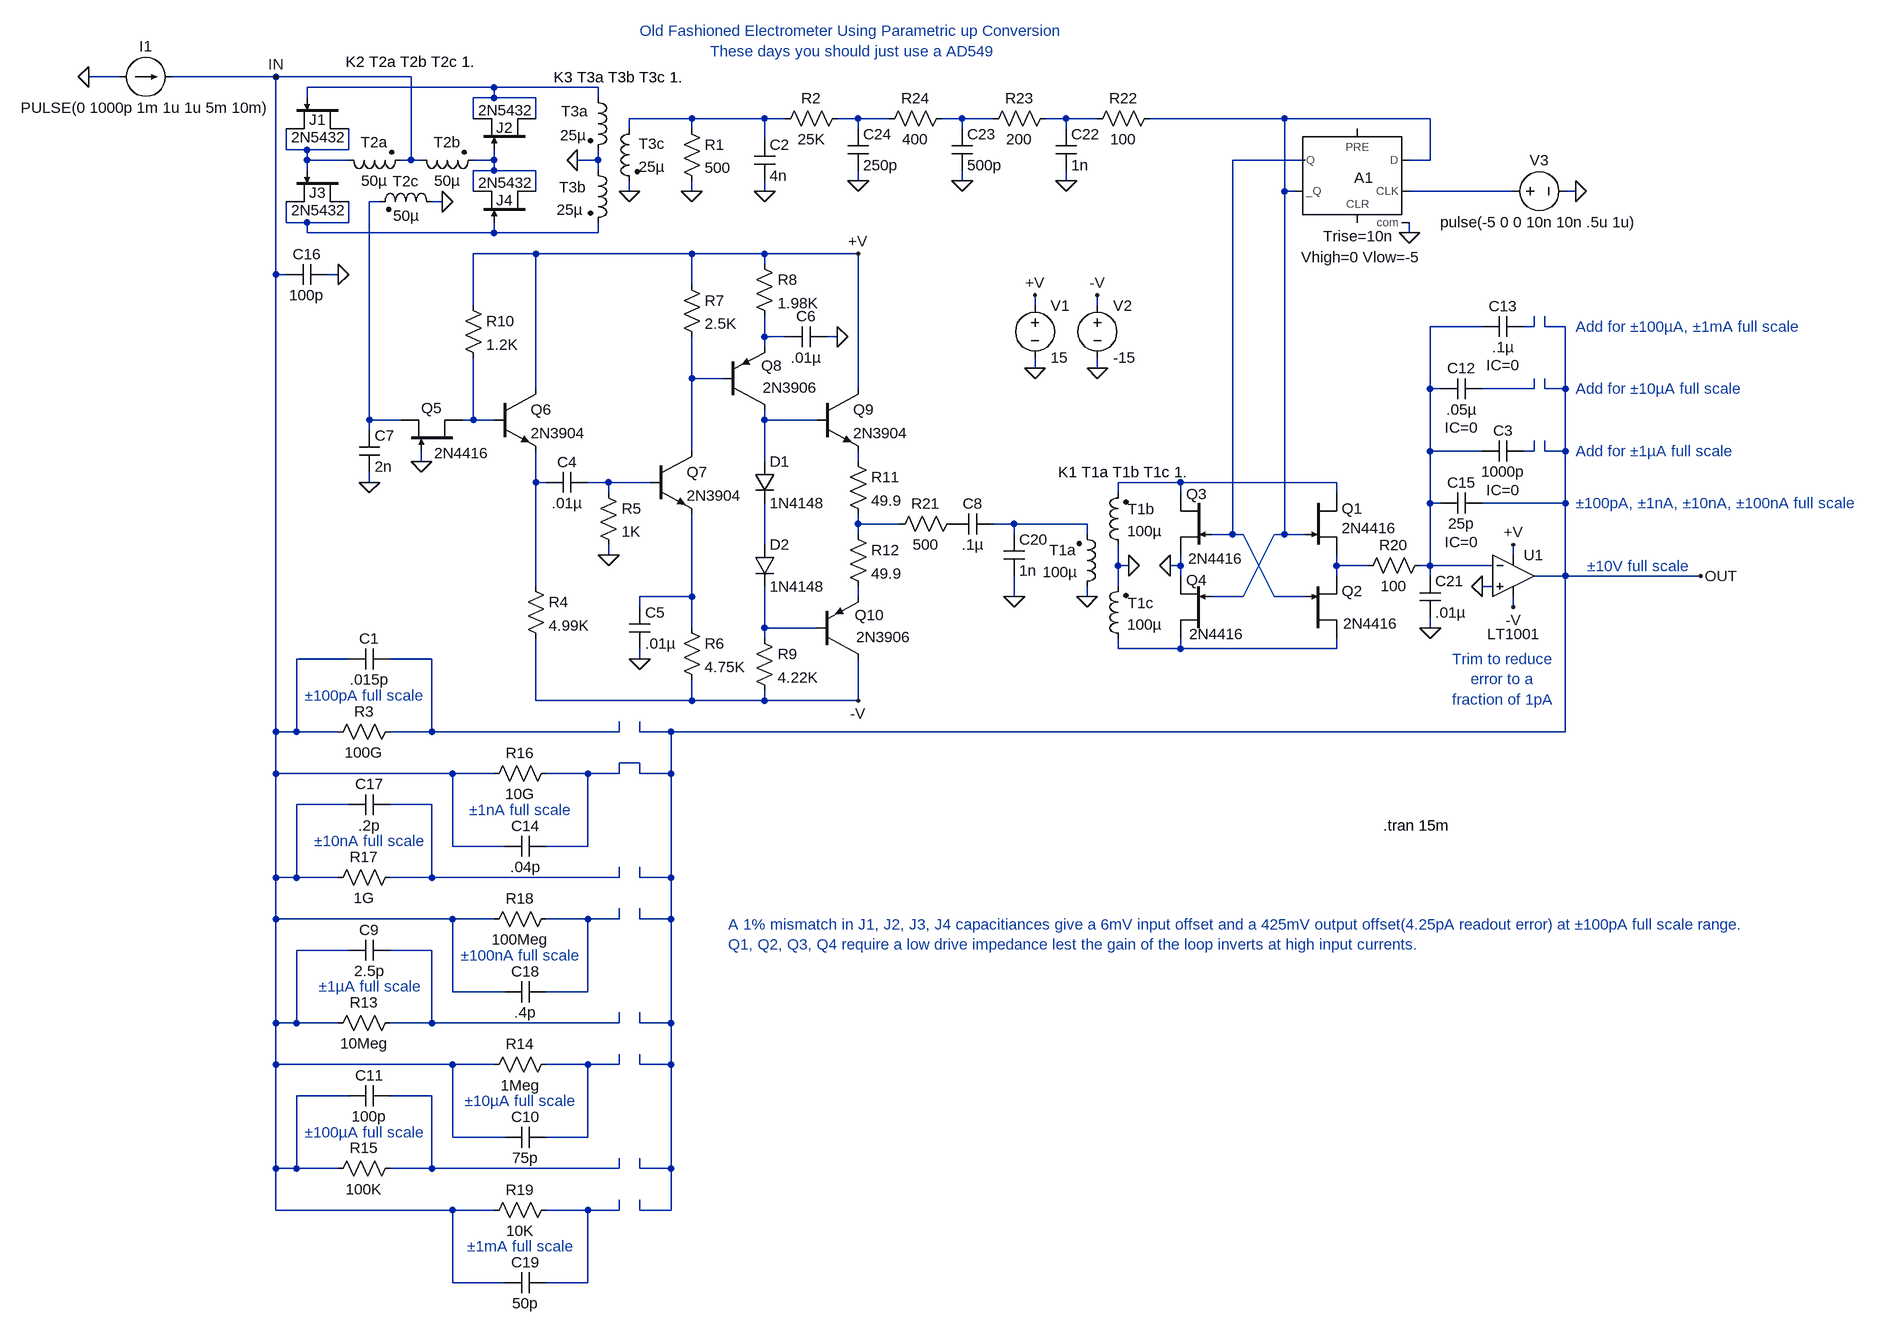
[diagram p0: schematic Electrometer.asc]
Electrometer.asc, the LTspice schematic file:
Version 4
SHEET 1 2884 3000
WIRE -1152 240 -1200 240
WIRE -912 240 -1072 240
WIRE -704 240 -912 240
WIRE -576 256 -864 256
WIRE -416 256 -576 256
WIRE -864 272 -864 256
WIRE -576 272 -576 256
WIRE -576 272 -608 272
WIRE -512 272 -576 272
WIRE -416 272 -416 256
WIRE -608 304 -608 272
WIRE -512 304 -512 272
WIRE -272 304 -368 304
WIRE -160 304 -272 304
WIRE -128 304 -160 304
WIRE -16 304 -48 304
WIRE 32 304 -16 304
WIRE 144 304 112 304
WIRE 192 304 144 304
WIRE 304 304 272 304
WIRE 352 304 304 304
WIRE 640 304 432 304
WIRE 864 304 640 304
WIRE -368 320 -368 304
WIRE -272 320 -272 304
WIRE -16 320 -16 304
WIRE 144 320 144 304
WIRE 304 320 304 304
WIRE -160 336 -160 304
WIRE -896 352 -896 320
WIRE -864 352 -896 352
WIRE -800 352 -800 320
WIRE -800 352 -864 352
WIRE -864 368 -864 352
WIRE -800 368 -864 368
WIRE -704 368 -704 240
WIRE -704 368 -720 368
WIRE -688 368 -704 368
WIRE -576 368 -576 352
WIRE -576 368 -608 368
WIRE -416 368 -416 352
WIRE -416 368 -448 368
WIRE 672 368 560 368
WIRE 864 368 864 304
WIRE 864 368 832 368
WIRE -864 384 -864 368
WIRE -576 384 -576 368
WIRE -576 384 -608 384
WIRE -512 384 -576 384
WIRE -416 384 -416 368
WIRE -16 400 -16 384
WIRE 144 400 144 384
WIRE 304 400 304 384
WIRE -608 416 -608 384
WIRE -512 416 -512 384
WIRE -368 416 -368 400
WIRE -272 416 -272 400
WIRE -160 416 -160 400
WIRE 640 416 640 304
WIRE 656 416 640 416
WIRE 992 416 832 416
WIRE 1088 416 1072 416
WIRE -752 432 -768 432
WIRE -656 432 -672 432
WIRE -896 464 -896 432
WIRE -864 464 -896 464
WIRE -800 464 -800 432
WIRE -800 464 -864 464
WIRE -864 480 -864 464
WIRE -576 480 -576 464
WIRE -576 480 -864 480
WIRE -416 480 -416 464
WIRE -416 480 -576 480
WIRE 832 480 832 464
WIRE -512 512 -608 512
WIRE -272 512 -512 512
WIRE -160 512 -272 512
WIRE -16 512 -160 512
WIRE -160 528 -160 512
WIRE -912 544 -912 240
WIRE -896 544 -912 544
WIRE -816 544 -832 544
WIRE -272 560 -272 512
WIRE -608 592 -608 512
WIRE 256 592 256 576
WIRE 352 592 352 576
WIRE 944 624 864 624
WIRE 1024 624 1024 608
WIRE 1024 624 1008 624
WIRE 1040 624 1040 608
WIRE 1072 624 1040 624
WIRE -160 640 -160 608
WIRE -128 640 -160 640
WIRE -48 640 -64 640
WIRE -160 656 -160 640
WIRE 256 688 256 672
WIRE 352 688 352 672
WIRE -272 704 -272 640
WIRE -224 704 -272 704
WIRE -512 720 -512 512
WIRE -16 720 -16 512
WIRE 864 720 864 624
WIRE 880 720 864 720
WIRE 1024 720 1024 704
WIRE 1024 720 944 720
WIRE 1040 720 1040 704
WIRE 1072 720 1072 624
WIRE 1072 720 1040 720
WIRE -768 768 -768 432
WIRE -720 768 -768 768
WIRE -608 768 -608 672
WIRE -608 768 -624 768
WIRE -576 768 -608 768
WIRE -160 768 -160 752
WIRE -80 768 -160 768
WIRE -768 784 -768 768
WIRE -272 816 -272 704
WIRE 864 816 864 720
WIRE 944 816 864 816
WIRE 1024 816 1024 800
WIRE 1024 816 1008 816
WIRE 1040 816 1040 800
WIRE 1072 816 1072 720
WIRE 1072 816 1040 816
WIRE -688 832 -688 816
WIRE -160 832 -160 768
WIRE -16 832 -16 816
WIRE -768 864 -768 848
WIRE -512 864 -512 816
WIRE -496 864 -512 864
WIRE -400 864 -432 864
WIRE -336 864 -400 864
WIRE 480 864 384 864
WIRE 720 864 480 864
WIRE -400 880 -400 864
WIRE 384 880 384 864
WIRE 480 880 480 864
WIRE 720 880 720 864
WIRE 864 896 864 816
WIRE 880 896 864 896
WIRE 1072 896 1072 816
WIRE 1072 896 944 896
WIRE -16 928 -16 912
WIRE 48 928 -16 928
WIRE 224 928 192 928
WIRE 336 928 224 928
WIRE -16 944 -16 928
WIRE 224 944 224 928
WIRE 336 944 336 928
WIRE 560 944 560 368
WIRE 560 944 528 944
WIRE 576 944 560 944
WIRE 640 944 640 416
WIRE 640 944 624 944
WIRE 672 944 640 944
WIRE -160 960 -160 896
WIRE -400 976 -400 960
WIRE 992 976 992 960
WIRE 384 992 384 960
WIRE 400 992 384 992
WIRE 480 992 480 976
WIRE 480 992 464 992
WIRE 720 992 720 976
WIRE 768 992 720 992
WIRE 864 992 864 896
WIRE 864 992 848 992
WIRE 960 992 864 992
WIRE 480 1008 480 992
WIRE 720 1008 720 992
WIRE 864 1008 864 992
WIRE 1072 1008 1072 896
WIRE 1072 1008 1024 1008
WIRE 1280 1008 1072 1008
WIRE -512 1024 -512 864
WIRE 384 1024 384 992
WIRE 960 1024 944 1024
WIRE -272 1040 -272 912
WIRE -272 1040 -352 1040
WIRE -16 1040 -16 1024
WIRE 224 1040 224 1008
WIRE 336 1040 336 1024
WIRE 576 1040 624 944
WIRE 576 1040 528 1040
WIRE 624 1040 576 944
WIRE 672 1040 624 1040
WIRE -352 1056 -352 1040
WIRE 992 1056 992 1040
WIRE -272 1088 -272 1040
WIRE -160 1088 -160 1024
WIRE -80 1088 -160 1088
WIRE 864 1088 864 1072
WIRE -160 1104 -160 1088
WIRE 384 1120 384 1104
WIRE 480 1120 480 1104
WIRE 480 1120 384 1120
WIRE 720 1120 720 1104
WIRE 720 1120 480 1120
WIRE -800 1136 -880 1136
WIRE -672 1136 -736 1136
WIRE -352 1136 -352 1120
WIRE -512 1200 -512 1104
WIRE -272 1200 -272 1168
WIRE -272 1200 -512 1200
WIRE -160 1200 -160 1184
WIRE -160 1200 -272 1200
WIRE -16 1200 -16 1136
WIRE -16 1200 -160 1200
WIRE -912 1248 -912 544
WIRE -880 1248 -880 1136
WIRE -880 1248 -912 1248
WIRE -816 1248 -880 1248
WIRE -672 1248 -672 1136
WIRE -672 1248 -736 1248
WIRE -384 1248 -384 1232
WIRE -384 1248 -672 1248
WIRE -352 1248 -352 1232
WIRE -304 1248 -352 1248
WIRE 1072 1248 1072 1008
WIRE 1072 1248 -304 1248
WIRE -352 1296 -384 1296
WIRE -912 1312 -912 1248
WIRE -640 1312 -912 1312
WIRE -576 1312 -640 1312
WIRE -432 1312 -496 1312
WIRE -384 1312 -384 1296
WIRE -384 1312 -432 1312
WIRE -352 1312 -352 1296
WIRE -304 1312 -304 1248
WIRE -304 1312 -352 1312
WIRE -800 1360 -880 1360
WIRE -672 1360 -736 1360
WIRE -640 1424 -640 1312
WIRE -560 1424 -640 1424
WIRE -432 1424 -432 1312
WIRE -432 1424 -496 1424
WIRE -912 1472 -912 1312
WIRE -880 1472 -880 1360
WIRE -880 1472 -912 1472
WIRE -816 1472 -880 1472
WIRE -672 1472 -672 1360
WIRE -672 1472 -736 1472
WIRE -384 1472 -384 1456
WIRE -384 1472 -672 1472
WIRE -352 1472 -352 1456
WIRE -304 1472 -304 1312
WIRE -304 1472 -352 1472
WIRE -912 1536 -912 1472
WIRE -640 1536 -912 1536
WIRE -576 1536 -640 1536
WIRE -432 1536 -496 1536
WIRE -384 1536 -384 1520
WIRE -384 1536 -432 1536
WIRE -352 1536 -352 1520
WIRE -304 1536 -304 1472
WIRE -304 1536 -352 1536
WIRE -800 1584 -880 1584
WIRE -672 1584 -736 1584
WIRE -640 1648 -640 1536
WIRE -560 1648 -640 1648
WIRE -432 1648 -432 1536
WIRE -432 1648 -496 1648
WIRE -912 1696 -912 1536
WIRE -880 1696 -880 1584
WIRE -880 1696 -912 1696
WIRE -816 1696 -880 1696
WIRE -672 1696 -672 1584
WIRE -672 1696 -736 1696
WIRE -384 1696 -384 1680
WIRE -384 1696 -672 1696
WIRE -352 1696 -352 1680
WIRE -304 1696 -304 1536
WIRE -304 1696 -352 1696
WIRE -912 1760 -912 1696
WIRE -640 1760 -912 1760
WIRE -576 1760 -640 1760
WIRE -432 1760 -496 1760
WIRE -384 1760 -384 1744
WIRE -384 1760 -432 1760
WIRE -352 1760 -352 1744
WIRE -304 1760 -304 1696
WIRE -304 1760 -352 1760
WIRE -800 1808 -880 1808
WIRE -672 1808 -736 1808
WIRE -640 1872 -640 1760
WIRE -560 1872 -640 1872
WIRE -432 1872 -432 1760
WIRE -432 1872 -496 1872
WIRE -912 1920 -912 1760
WIRE -880 1920 -880 1808
WIRE -880 1920 -912 1920
WIRE -816 1920 -880 1920
WIRE -672 1920 -672 1808
WIRE -672 1920 -736 1920
WIRE -384 1920 -384 1904
WIRE -384 1920 -672 1920
WIRE -352 1920 -352 1904
WIRE -304 1920 -304 1760
WIRE -304 1920 -352 1920
WIRE -912 1984 -912 1920
WIRE -640 1984 -912 1984
WIRE -576 1984 -640 1984
WIRE -432 1984 -496 1984
WIRE -384 1984 -384 1968
WIRE -384 1984 -432 1984
WIRE -352 1984 -352 1968
WIRE -304 1984 -304 1920
WIRE -304 1984 -352 1984
WIRE -640 2096 -640 1984
WIRE -560 2096 -640 2096
WIRE -432 2096 -432 1984
WIRE -432 2096 -496 2096
FLAG 256 688 0
FLAG -272 416 0
FLAG -368 416 0
FLAG 336 1040 0
FLAG 400 992 0
FLAG 464 992 0
FLAG 352 688 0
FLAG 256 576 +V
FLAG 352 576 -V
FLAG 992 960 +V
FLAG 992 1056 -V
FLAG 944 1024 0
FLAG -1200 240 0
FLAG 1280 1008 OUT
FLAG -656 432 0
FLAG -448 368 0
FLAG -160 416 0
FLAG -688 832 0
FLAG -400 976 0
FLAG -352 1136 0
FLAG -48 640 0
FLAG -16 1200 -V
FLAG -16 512 +V
FLAG -768 864 0
FLAG -816 544 0
FLAG -912 240 IN
FLAG 224 1040 0
FLAG 1088 416 0
FLAG 832 480 0
FLAG 864 1088 0
FLAG 304 400 0
FLAG 144 400 0
FLAG -16 400 0
SYMBOL voltage 256 576 R0
SYMATTR InstName V1
SYMATTR Value 15
SYMBOL ind2 -432 256 R0
WINDOW 0 1 37 Right 2
WINDOW 3 -2 74 Right 2
SYMATTR InstName T3a
SYMATTR Value 25µ
SYMATTR Type ind
SYMBOL ind2 -432 368 R0
WINDOW 0 -2 42 Right 2
WINDOW 3 -7 76 Right 2
SYMATTR InstName T3b
SYMATTR Value 25µ
SYMATTR Type ind
SYMBOL ind2 -352 304 M0
WINDOW 0 2 39 Right 2
WINDOW 3 2 74 Right 2
SYMATTR InstName T3c
SYMATTR Value 25µ
SYMATTR Type ind
SYMBOL res -288 304 R0
SYMATTR InstName R1
SYMATTR Value 500
SYMBOL res -32 288 R90
WINDOW 0 0 56 VBottom 2
WINDOW 3 32 56 VTop 2
SYMATTR InstName R2
SYMATTR Value 25K
SYMBOL ind2 400 976 R180
WINDOW 0 1 71 Right 2
WINDOW 3 2 37 Right 2
SYMATTR InstName T1b
SYMATTR Value 100µ
SYMATTR Type ind
SYMBOL ind2 400 1120 R180
WINDOW 0 1 70 Right 2
WINDOW 3 2 37 Right 2
SYMATTR InstName T1c
SYMATTR Value 100µ
SYMATTR Type ind
SYMBOL ind2 320 1040 M180
WINDOW 0 0 72 Right 2
WINDOW 3 2 38 Right 2
SYMATTR InstName T1a
SYMATTR Value 100µ
SYMATTR Type ind
SYMBOL njf 672 880 R0
WINDOW 3 56 54 Left 2
WINDOW 0 56 24 Left 2
SYMATTR Value 2N4416
SYMATTR InstName Q1
SYMBOL njf 672 1104 M180
WINDOW 0 56 73 Left 2
WINDOW 3 58 23 Left 2
SYMATTR InstName Q2
SYMATTR Value 2N4416
SYMBOL njf 528 880 M0
WINDOW 0 39 2 Right 2
WINDOW 3 36 101 Right 2
SYMATTR InstName Q3
SYMATTR Value 2N4416
SYMBOL njf 528 1104 R180
WINDOW 0 39 90 Right 2
WINDOW 3 35 7 Right 2
SYMATTR InstName Q4
SYMATTR Value 2N4416
SYMBOL voltage 352 576 R0
SYMATTR InstName V2
SYMATTR Value -15
SYMBOL current -1152 240 M90
WINDOW 0 -32 40 VBottom 2
WINDOW 3 32 40 VTop 2
WINDOW 123 74 40 VTop 2
WINDOW 39 53 40 VTop 2
SYMATTR InstName I1
SYMATTR Value PULSE(0 1000p 1m 1u 1u 5m 10m)
SYMBOL res -720 1232 R90
WINDOW 0 0 56 VBottom 2
WINDOW 3 32 56 VTop 2
SYMATTR InstName R3
SYMATTR Value 100G
SYMBOL cap -736 1120 R90
WINDOW 0 0 32 VBottom 2
WINDOW 3 32 32 VTop 2
SYMATTR InstName C1
SYMATTR Value .015p
SYMBOL ind2 -816 352 M90
WINDOW 0 4 56 VBottom 2
WINDOW 3 32 56 VTop 2
SYMATTR InstName T2a
SYMATTR Value 50µ
SYMATTR Type ind
SYMBOL ind2 -704 352 M90
WINDOW 0 4 56 VBottom 2
WINDOW 3 32 56 VTop 2
SYMATTR InstName T2b
SYMATTR Value 50µ
SYMATTR Type ind
SYMBOL ind2 -656 448 M270
WINDOW 0 32 56 VTop 2
WINDOW 3 10 55 VBottom 2
SYMATTR InstName T2c
SYMATTR Value 50µ
SYMATTR Type ind
SYMBOL cap -176 400 M180
WINDOW 0 24 56 Left 2
WINDOW 3 24 8 Left 2
SYMATTR InstName C2
SYMATTR Value 4n
SYMBOL cap 1008 800 R90
WINDOW 0 0 32 VBottom 2
WINDOW 3 32 32 VTop 2
WINDOW 123 60 32 VTop 2
SYMATTR InstName C3
SYMATTR Value 1000p
SYMATTR Value2 IC=0
SYMBOL Opamps\\LT1001 992 944 R0
WINDOW 3 -40 153 Left 2
SYMATTR InstName U1
SYMBOL njf -624 816 M270
WINDOW 0 51 48 VTop 2
WINDOW 3 -3 44 VLeft 2
SYMATTR InstName Q5
SYMATTR Value 2N4416
SYMBOL npn -576 720 R0
SYMATTR InstName Q6
SYMATTR Value 2N3904
SYMBOL res -528 1008 R0
SYMATTR InstName R4
SYMATTR Value 4.99K
SYMBOL cap -432 848 R90
WINDOW 0 0 32 VBottom 2
WINDOW 3 32 32 VTop 2
SYMATTR InstName C4
SYMATTR Value .01µ
SYMBOL res -416 864 R0
SYMATTR InstName R5
SYMATTR Value 1K
SYMBOL npn -336 816 R0
SYMATTR InstName Q7
SYMATTR Value 2N3904
SYMBOL res -288 1072 R0
SYMATTR InstName R6
SYMATTR Value 4.75K
SYMBOL cap -368 1056 R0
SYMATTR InstName C5
SYMATTR Value .01µ
SYMBOL res -288 544 R0
SYMATTR InstName R7
SYMATTR Value 2.5K
SYMBOL pnp -224 752 M180
WINDOW 0 59 68 Left 2
WINDOW 3 61 34 Left 2
SYMATTR InstName Q8
SYMATTR Value 2N3906
SYMBOL res -176 512 R0
SYMATTR InstName R8
SYMATTR Value 1.98K
SYMBOL cap -128 624 M90
WINDOW 0 0 32 VBottom 2
WINDOW 3 32 32 VTop 2
SYMATTR InstName C6
SYMATTR Value .01µ
SYMBOL res -176 1088 R0
SYMATTR InstName R9
SYMATTR Value 4.22K
SYMBOL npn -80 720 R0
SYMATTR InstName Q9
SYMATTR Value 2N3904
SYMBOL cap -784 848 M180
WINDOW 0 24 56 Left 2
WINDOW 3 24 8 Left 2
SYMATTR InstName C7
SYMATTR Value 2n
SYMBOL res -624 576 R0
SYMATTR InstName R10
SYMATTR Value 1.2K
SYMBOL pnp -80 1136 M180
WINDOW 0 59 68 Left 2
WINDOW 3 61 34 Left 2
SYMATTR InstName Q10
SYMATTR Value 2N3906
SYMBOL diode -176 832 R0
SYMATTR InstName D1
SYMATTR Value 1N4148
SYMBOL diode -176 960 R0
SYMATTR InstName D2
SYMATTR Value 1N4148
SYMBOL res -32 816 R0
SYMATTR InstName R11
SYMATTR Value 49.9
SYMBOL res -32 928 R0
SYMATTR InstName R12
SYMATTR Value 49.9
SYMBOL cap 192 912 R90
WINDOW 0 0 32 VBottom 2
WINDOW 3 32 32 VTop 2
WINDOW 39 60 32 VTop 2
SYMATTR InstName C8
SYMATTR Value .1µ
SYMBOL res -720 1680 R90
WINDOW 0 0 56 VBottom 2
WINDOW 3 32 56 VTop 2
SYMATTR InstName R13
SYMATTR Value 10Meg
SYMBOL cap -736 1568 R90
WINDOW 0 0 32 VBottom 2
WINDOW 3 32 32 VTop 2
SYMATTR InstName C9
SYMATTR Value 2.5p
SYMBOL res -480 1744 R90
WINDOW 0 0 56 VBottom 2
WINDOW 3 32 56 VTop 2
SYMATTR InstName R14
SYMATTR Value 1Meg
SYMBOL res -720 1904 R90
WINDOW 0 0 56 VBottom 2
WINDOW 3 32 56 VTop 2
SYMATTR InstName R15
SYMATTR Value 100K
SYMBOL cap -496 1856 R90
WINDOW 0 0 32 VBottom 2
WINDOW 3 32 32 VTop 2
SYMATTR InstName C10
SYMATTR Value 75p
SYMBOL cap -736 1792 R90
WINDOW 0 0 32 VBottom 2
WINDOW 3 32 32 VTop 2
SYMATTR InstName C11
SYMATTR Value 100p
SYMBOL cap 944 704 R90
WINDOW 0 0 32 VBottom 2
WINDOW 3 32 32 VTop 2
WINDOW 123 60 32 VTop 2
SYMATTR InstName C12
SYMATTR Value .05µ
SYMATTR Value2 IC=0
SYMBOL cap 1008 608 R90
WINDOW 0 0 32 VBottom 2
WINDOW 3 32 32 VTop 2
WINDOW 123 60 32 VTop 2
SYMATTR InstName C13
SYMATTR Value .1µ
SYMATTR Value2 IC=0
SYMBOL njf -800 384 R90
WINDOW 0 34 48 VCenter 2
WINDOW 3 61 46 VCenter 2
SYMATTR InstName J3
SYMATTR Value 2N5432
SYMBOL njf -800 272 R90
WINDOW 0 34 48 VCenter 2
WINDOW 3 61 46 VCenter 2
SYMATTR InstName J1
SYMATTR Value 2N5432
SYMBOL njf -512 464 M270
WINDOW 0 34 48 VCenter 2
WINDOW 3 61 46 VCenter 2
SYMATTR InstName J4
SYMATTR Value 2N5432
SYMBOL njf -512 352 M270
WINDOW 0 34 48 VCenter 2
WINDOW 3 61 46 VCenter 2
SYMATTR InstName J2
SYMATTR Value 2N5432
SYMBOL res -480 1296 R90
WINDOW 0 0 56 VBottom 2
WINDOW 3 32 56 VTop 2
SYMATTR InstName R16
SYMATTR Value 10G
SYMBOL cap -496 1408 R90
WINDOW 0 0 32 VBottom 2
WINDOW 3 32 32 VTop 2
SYMATTR InstName C14
SYMATTR Value .04p
SYMBOL cap 944 880 R90
WINDOW 0 0 32 VBottom 2
WINDOW 3 32 32 VTop 2
WINDOW 123 60 32 VTop 2
SYMATTR InstName C15
SYMATTR Value 25p
SYMATTR Value2 IC=0
SYMBOL cap -896 528 M90
WINDOW 0 0 32 VBottom 2
WINDOW 3 32 32 VTop 2
SYMATTR InstName C16
SYMATTR Value 100p
SYMBOL res -720 1456 R90
WINDOW 0 0 56 VBottom 2
WINDOW 3 32 56 VTop 2
SYMATTR InstName R17
SYMATTR Value 1G
SYMBOL cap -736 1344 R90
WINDOW 0 0 32 VBottom 2
WINDOW 3 32 32 VTop 2
SYMATTR InstName C17
SYMATTR Value .2p
SYMBOL res -480 1520 R90
WINDOW 0 0 56 VBottom 2
WINDOW 3 32 56 VTop 2
SYMATTR InstName R18
SYMATTR Value 100Meg
SYMBOL cap -496 1632 R90
WINDOW 0 0 32 VBottom 2
WINDOW 3 32 32 VTop 2
SYMATTR InstName C18
SYMATTR Value .4p
SYMBOL res -480 1968 R90
WINDOW 0 0 56 VBottom 2
WINDOW 3 32 56 VTop 2
SYMATTR InstName R19
SYMATTR Value 10K
SYMBOL cap -496 2080 R90
WINDOW 0 0 32 VBottom 2
WINDOW 3 32 32 VTop 2
SYMATTR InstName C19
SYMATTR Value 50p
SYMBOL cap 208 1008 M180
WINDOW 0 24 56 Left 2
WINDOW 3 24 8 Left 2
SYMATTR InstName C20
SYMATTR Value 1n
SYMBOL Digital\\dflop 752 320 M0
WINDOW 0 -10 75 Center 2
WINDOW 3 -97 197 Left 2
WINDOW 123 -56 165 Left 2
SYMATTR InstName A1
SYMATTR Value Vhigh=0 Vlow=-5
SYMATTR Value2 Trise=10n
SYMBOL voltage 976 416 R270
WINDOW 0 32 56 VTop 2
WINDOW 3 -32 56 VBottom 2
SYMATTR InstName V3
SYMATTR Value pulse(-5 0 0 10n 10n .5u 1u)
SYMBOL cap 848 1008 R0
SYMATTR InstName C21
SYMATTR Value .01µ
SYMBOL res 864 976 R90
WINDOW 0 0 56 VBottom 2
WINDOW 3 32 56 VTop 2
SYMATTR InstName R20
SYMATTR Value 100
SYMBOL res 144 912 R90
WINDOW 0 0 56 VBottom 2
WINDOW 3 32 56 VTop 2
SYMATTR InstName R21
SYMATTR Value 500
SYMBOL cap 288 320 R0
SYMATTR InstName C22
SYMATTR Value 1n
SYMBOL res 448 288 R90
WINDOW 0 0 56 VBottom 2
WINDOW 3 32 56 VTop 2
SYMATTR InstName R22
SYMATTR Value 100
SYMBOL cap 128 320 R0
SYMATTR InstName C23
SYMATTR Value 500p
SYMBOL res 288 288 R90
WINDOW 0 0 56 VBottom 2
WINDOW 3 32 56 VTop 2
SYMATTR InstName R23
SYMATTR Value 200
SYMBOL cap -32 320 R0
SYMATTR InstName C24
SYMATTR Value 250p
SYMBOL res 128 288 R90
WINDOW 0 0 56 VBottom 2
WINDOW 3 32 56 VTop 2
SYMATTR InstName R24
SYMATTR Value 400
TEXT 792 1392 Left 2 !.tran 15m
TEXT -384 256 Bottom 2 !K3 T3a T3b T3c 1.
TEXT 392 864 Bottom 2 !K1 T1a T1b T1c 1.
TEXT -704 232 Bottom 2 !K2 T2a T2b T2c 1.
TEXT -24 216 Bottom 2 ;Old Fashioned Electrometer Using Parametric up Conversion\nThese days you should just use a AD549
TEXT -536 1368 Center 2 ;±1nA full scale
TEXT -768 1640 Center 2 ;±1µA full scale
TEXT -776 1864 Center 2 ;±100µA full scale
TEXT 1088 816 Left 2 ;Add for ±1µA full scale
TEXT -536 1816 Center 2 ;±10µA full scale
TEXT 1088 624 Left 2 ;Add for ±100µA, ±1mA full scale
TEXT -776 1192 Center 2 ;±100pA full scale
TEXT 1088 896 Left 2 ;±100pA, ±1nA, ±10nA, ±100nA full scale
TEXT -768 1416 Center 2 ;±10nA full scale
TEXT -536 1592 Center 2 ;±100nA full scale
TEXT 1088 720 Left 2 ;Add for ±10µA full scale
TEXT -536 2040 Center 2 ;±1mA full scale
TEXT -216 1544 Left 2 ;A 1% mismatch in J1, J2, J3, J4 capacitiances give a 6mV input offset and a 425mV output offset(4.25pA readout error) at ±100pA full scale range.\nQ1, Q2, Q3, Q4 require a low drive impedance lest the gain of the loop inverts at high input currents.
TEXT 1184 1008 Bottom 2 ;±10V full scale
TEXT 976 1120 Top 2 ;Trim to reduce\nerror to a\nfraction of 1pA

The netlist it stands for:
* Electrometer.asc
V1 +V 0 15
L§T3a N001 0 25µ
L§T3b 0 N012 25µ
L§T3c N002 0 25µ
R1 N002 0 500
R2 N003 N002 25K
L§T1b 0 N024 100µ
L§T1c N032 0 100µ
L§T1a 0 N026 100µ
J§Q1 N024 N006 N028 2N4416
J§Q2 N032 N009 N028 2N4416
J§Q3 N024 N009 0 2N4416
J§Q4 N032 N006 0 2N4416
V2 -V 0 -15
I1 0 IN PULSE(0 1000p 1m 1u 1u 5m 10m)
R3 N033 IN 100G
C1 N033 IN .015p
L§T2a N007 IN 50µ
L§T2b IN N008 50µ
L§T2c 0 N011 50µ
C2 0 N002 4n
C3 N020 N013 1000p IC=0
XU1 0 N013 +V -V OUT LT1001  ; pins In+ In- V+ V- OUT
J§Q5 N018 0 N011 2N4416
Q6 +V N018 N022 0 2N3904
R4 N022 -V 4.99K
C4 N023 N022 .01µ
R5 N023 0 1K
Q7 N016 N023 N029 0 2N3904
R6 N029 -V 4.75K
C5 N029 0 .01µ
R7 +V N016 2.5K
Q8 N019 N016 N015 0 2N3906
R8 +V N015 1.98K
C6 N015 0 .01µ
R9 N031 -V 4.22K
Q9 +V N019 N021 0 2N3904
C7 0 N011 2n
R10 +V N018 1.2K
Q10 -V N031 N030 0 2N3906
D1 N019 N027 1N4148
D2 N027 N031 1N4148
R11 N021 N025 49.9
R12 N025 N030 49.9
C8 N026 P001 .1µ
R13 N036 IN 10Meg
C9 N036 IN 2.5p
R14 N037 IN 1Meg
R15 N038 IN 100K
C10 N037 IN 75p
C11 N038 IN 100p
C12 N017 N013 .05µ IC=0
C13 N014 N013 .1µ IC=0
J3 N012 N007 N012 2N5432
J1 N007 N001 N007 2N5432
J4 N008 N012 N008 2N5432
J2 N001 N008 N001 2N5432
R16 OUT IN 10G
C14 OUT IN .04p
C15 OUT N013 25p IC=0
C16 IN 0 100p
R17 N034 IN 1G
C17 N034 IN .2p
R18 N035 IN 100Meg
C18 N035 IN .4p
R19 N039 IN 10K
C19 N039 IN 50p
C20 0 N026 1n
A1 N006 0 N010 0 0 N006 N009 0 DFLOP Vhigh=0 Vlow=-5 Trise=10n
V3 N010 0 pulse(-5 0 0 10n 10n .5u 1u)
C21 N013 0 .01µ
R20 N013 N028 100
R21 P001 N025 500
C22 N005 0 1n
R22 N006 N005 100
C23 N004 0 500p
R23 N005 N004 200
C24 N003 0 250p
R24 N004 N003 400
.model D D
.lib standard.dio
.model NPN NPN
.model PNP PNP
.lib standard.bjt
.model NJF NJF
.model PJF PJF
.lib standard.jft
.tran 15m
K3 T3a T3b T3c 1.
K1 T1a T1b T1c 1.
K2 T2a T2b T2c 1.
* Old Fashioned Electrometer Using Parametric up Conversion
* These days you should just use a AD549
* ±1nA full scale
* ±1µA full scale
* ±100µA full scale
* Add for ±1µA full scale
* ±10µA full scale
* Add for ±100µA, ±1mA full scale
* ±100pA full scale
* ±100pA, ±1nA, ±10nA, ±100nA full scale
* ±10nA full scale
* ±100nA full scale
* Add for ±10µA full scale
* ±1mA full scale
* A 1% mismatch in J1, J2, J3, J4 capacitiances give a 6mV input offset and a 425mV output offset(4.25pA readout error) at ±100pA full scale range.
* Q1, Q2, Q3, Q4 require a low drive impedance lest the gain of the loop inverts at high input currents.
* ±10V full scale
* Trim to reduce
* error to a
* fraction of 1pA
.lib LTC.lib
.backanno
.end